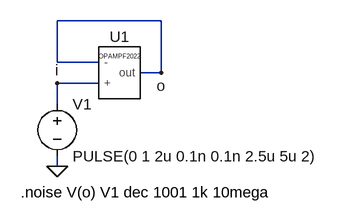
[diagram p0: schematic opamp_noise.asc]
opamp_noise.asc, the LTspice schematic file:
Version 4
SHEET 1 880 680
WIRE 272 32 112 32
WIRE 112 96 112 32
WIRE 176 96 112 96
WIRE 272 112 272 32
WIRE 272 112 240 112
WIRE 176 128 112 128
WIRE 112 160 112 128
WIRE 112 256 112 240
FLAG 112 256 0
FLAG 272 112 o
FLAG 112 128 i
SYMBOL voltage 112 144 R0
WINDOW 123 0 0 Left 0
WINDOW 39 0 0 Left 0
SYMATTR InstName V1
SYMATTR Value PULSE(0 1 2u 0.1n 0.1n 2.5u 5u 2)
SYMBOL OPAMPF2022 208 112 R0
SYMATTR InstName U1
TEXT 56 296 Left 2 !.noise V(o) V1 dec 1001 1k 10mega

The netlist it stands for:
* opamp_noise.asc
V1 i 0 PULSE(0 1 2u 0.1n 0.1n 2.5u 5u 2)
XU1 i o o OPAMPF2022  ; pins + - out
.noise V(o) V1 dec 1001 1k 10mega
.lib C:\Users\ricig\Desktop\Lavoro\LTspice\schematics\FULL2024.cir
.backanno
.end